# EasyEDA schematic Voxx Dott.json
TITLE: Voxx Dott; REV: 1.0; Date: 2026-04-01; Sheet: 1/1; Drawn By: timweiberg; Company: Your Company
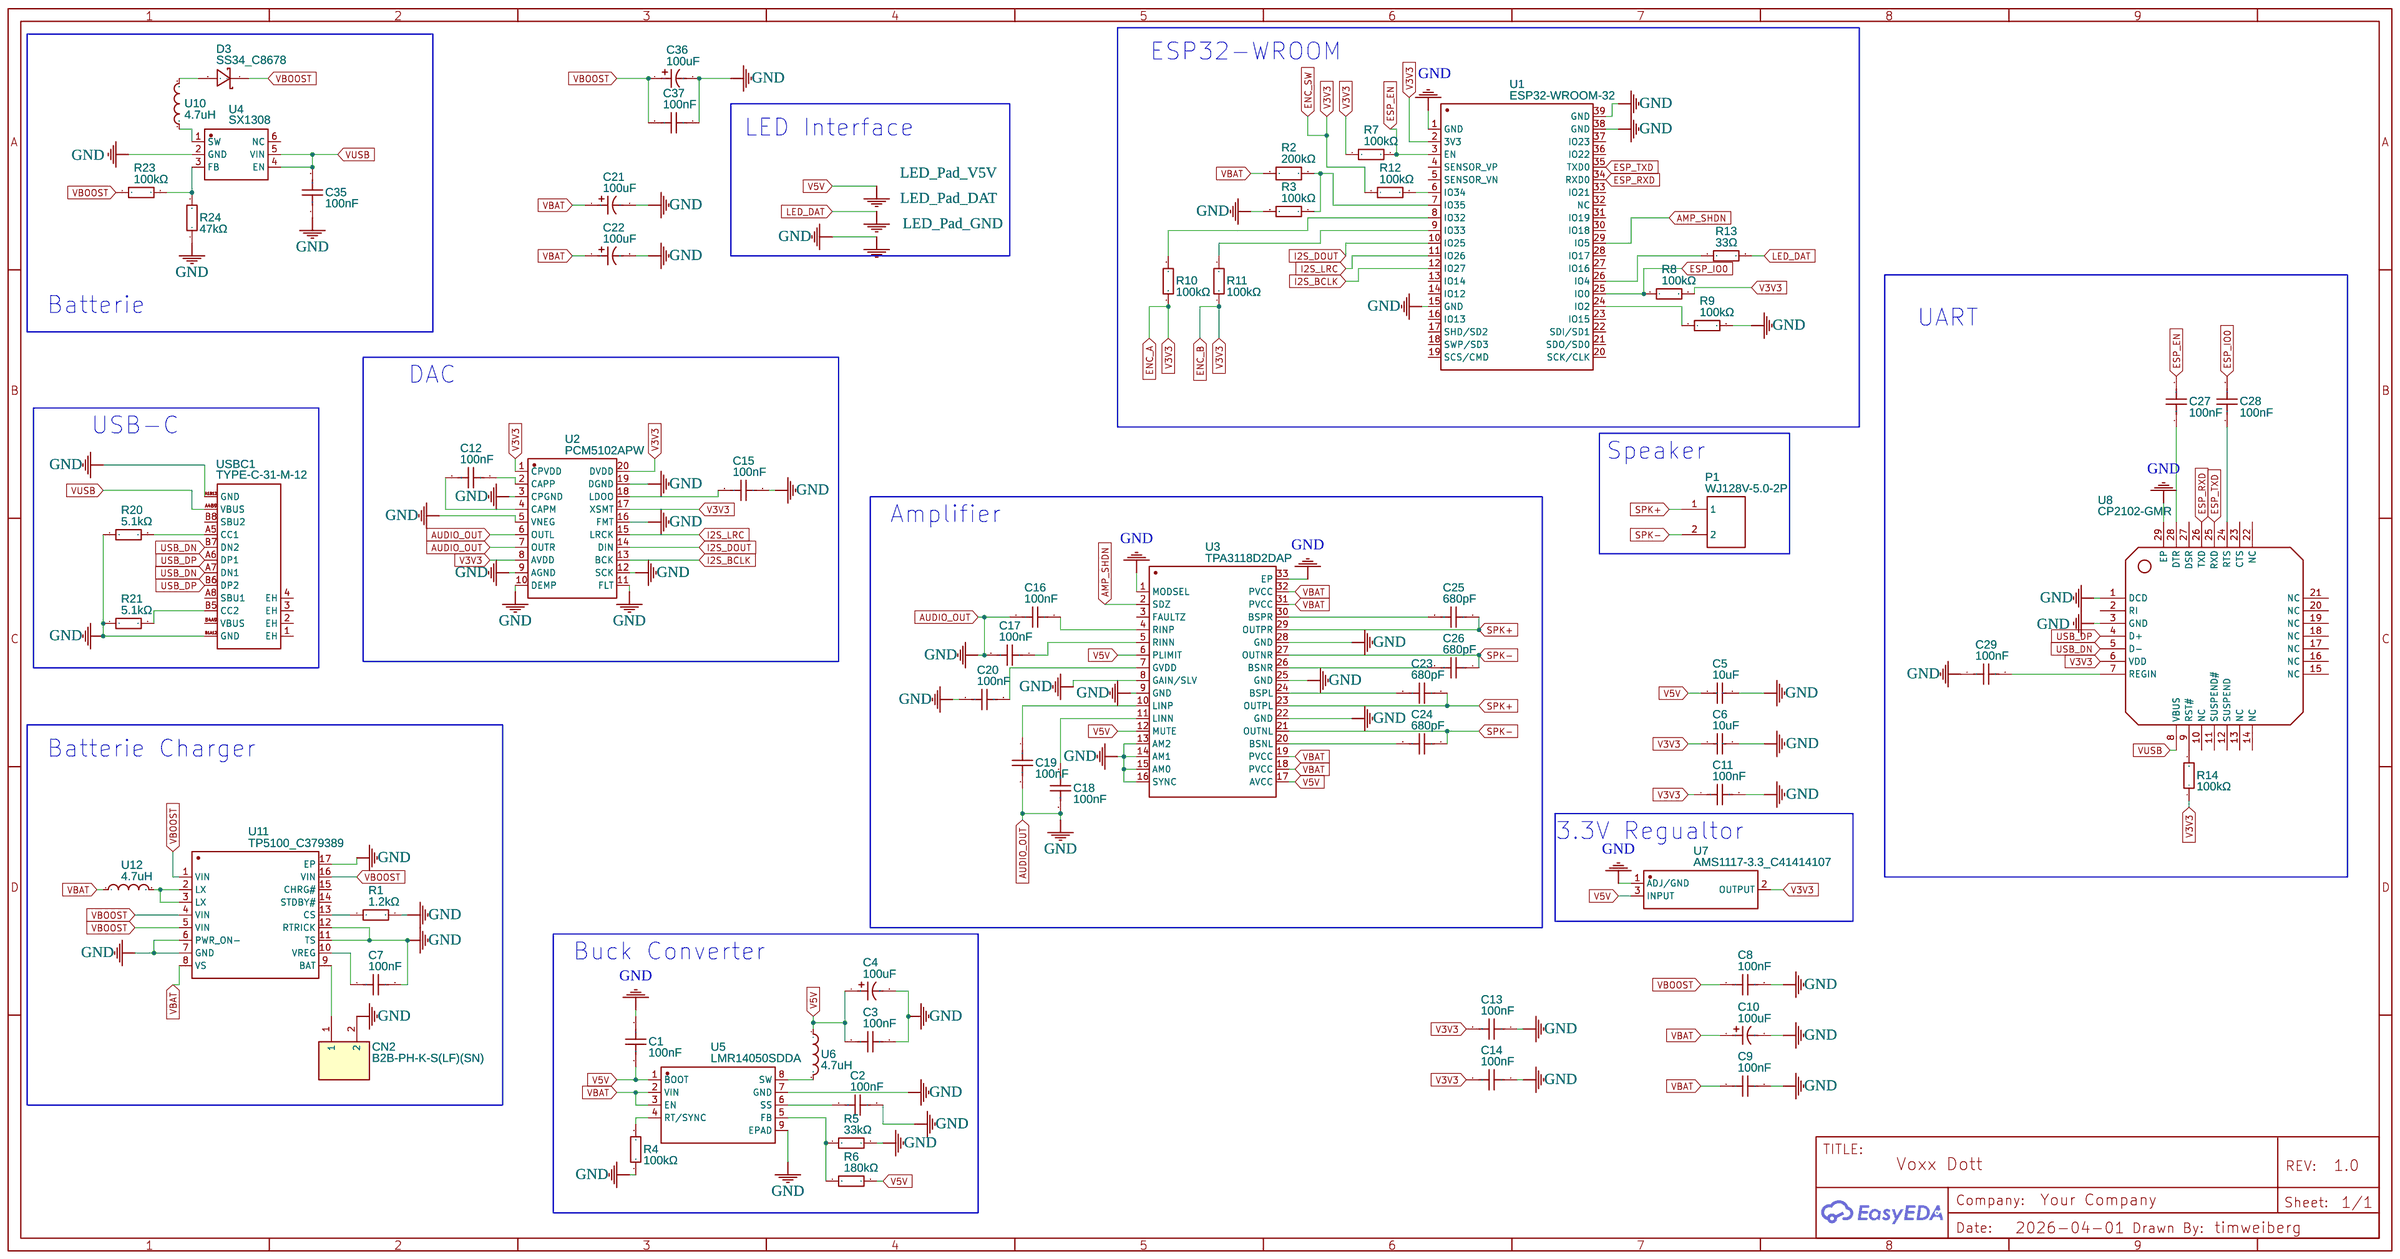
[diagram p0: schematic sheet]

## Parts
C1  100nF  [C0402]
C2  100nF  [C0402]
C3  100nF  [C0402]
C4  100uF  [CAP-SMD_BD6.3-L6.6-W6.6-LS7.3-FD]
C5  10uF  [C0805]
C6  10uF  [C0805]
C7  100nF  [C0402]
C8  100nF  [C0402]
C9  100nF  [C0402]
C10  100uF  [CAP-SMD_BD6.3-L6.6-W6.6-LS7.3-FD]
C11  100nF  [C0402]
C12  100nF  [C0402]
C13  100nF  [C0402]
C14  100nF  [C0402]
C15  100nF  [C0402]
C16  100nF  [C0402]
C17  100nF  [C0402]
C18  100nF  [C0402]
C19  100nF  [C0402]
C20  100nF  [C0402]
C21  100uF  [CAP-SMD_BD6.3-L6.6-W6.6-LS7.3-FD]
C22  100uF  [CAP-SMD_BD6.3-L6.6-W6.6-LS7.3-FD]
C23  680pF  [C0402]
C24  680pF  [C0402]
C25  680pF  [C0402]
C26  680pF  [C0402]
C27  100nF  [C0402]
C28  100nF  [C0402]
C29  100nF  [C0402]
C35  100nF  [C0402]
C36  100uF  [CAP-SMD_BD6.3-L6.6-W6.6-LS7.3-FD]
C37  100nF  [C0402]
CN2  B2B-PH-K-S(LF)(SN)  [CONN-TH_B2B-PH-K-S]
D3  SS34_C8678  [SMA_L4.3-W2.6-LS5.2-RD]
P1  WJ128V-5.0-2P  [CONN-TH_2P-P5.00_WJ128V-5.0-2P]
R1  1.2kΩ  [R0402]
R2  200kΩ  [R0402]
R3  100kΩ  [R0402]
R4  100kΩ  [R0402]
R5  33kΩ  [R0402]
R6  180kΩ  [R0402]
R7  100kΩ  [R0402]
R8  100kΩ  [R0402]
R9  100kΩ  [R0402]
R10  100kΩ  [R0402]
R11  100kΩ  [R0402]
R12  100kΩ  [R0402]
R13  33Ω  [R0402]
R14  100kΩ  [R0402]
R20  5.1kΩ  [R0402]
R21  5.1kΩ  [R0402]
R23  100kΩ  [R0402]
R24  47kΩ  [R0402]
U1  ESP32-WROOM-32  [WIFIM-SMD_ESP32-WROOM-32-N4]
U2  PCM5102APW  [TSSOP-20_L6.5-W4.4-P0.65-LS6.4-BL]
U3  TPA3118D2DAP  [HTSSOP-32_L11.0-W6.1-P0.65-LS8.1-BL-EP]
U4  SX1308  [SOT-23-6_L2.9-W1.6-P0.95-LS2.8-BL]
U5  LMR14050SDDA  [SOP-8_L4.9-W3.9-P1.27-LS6.0-BL-EP-2]
U6  4.7uH  [IND-SMD_L7.0-W6.6_APH0630]
U7  AMS1117-3.3_C41414107  [TO-252-2_L6.6-W5.6-P2.3-LS9.7]
U8  CP2102-GMR  [WQFN-28_L5.0-W5.0-P0.50-BL-EP3.2]
U10  4.7uH  [IND-SMD_L7.0-W6.6_APH0630]
U11  TP5100_C379389  [TQFN-16_L4.0-W4.0-P0.65-BL-EP]
U12  4.7uH  [IND-SMD_L7.0-W6.6_APH0630]
USBC1  TYPE-C-31-M-12  [USB-C_SMD-TYPE-C-31-M-12_1]

## Library data of the parts
C1-C3 C7-C9 C11-C20 C27-C29 C35 C37 = CC0402X7R50V104KN: Supplier: LCSC; Supplier Part: C53084447; Manufacturer: TORCH(火炬); Contributor: lcsc; JLCPCB Part Class: Extended Part
C4 C10 C21 C22 C36 = MA16V100M6X8: Supplier: LCSC; Supplier Part: C48971042; Manufacturer: JIERR(捷而瑞); JLCPCB Part Class: Extended Part; Contributor: lcsc
C5 C6 = CL21B106KPQNNNE: Supplier: LCSC; Manufacturer: SAMSUNG(三星); Supplier Part: C32635; JLCPCB Part Class: Extended Part
C23-C26 = CL05C681JB5NNNC: Contributor: LCSC; Supplier: LCSC; Supplier Part: C307451; Manufacturer: SAMSUNG(三星); JLCPCB Part Class: Extended Part
CN2 = B2B-PH-K-S(LF)(SN): Contributor: LCSC; Supplier: LCSC; Manufacturer: JST; Supplier Part: C131337; JLCPCB Part Class: Extended Part
D3 = SS34_C8678: Supplier: LCSC; Manufacturer Part: SS34; Manufacturer: MDD(辰达半导体); Supplier Part: C8678; JLCPCB Part Class: Basic Part
P1 = WJ128V-5.0-2P: Supplier: LCSC; Manufacturer: KANGNEX(康奈克斯电气); Manufacturer Part: WJ128V-5.0-02P-14-00A; Supplier Part: C8269; JLCPCB Part Class: Extended Part
R1 = RC0402FR-071K2L: Supplier: LCSC; Manufacturer: YAGEO(国巨); Supplier Part: C138040; JLCPCB Part Class: Extended Part
R2 = FRC0402F2003TS: Supplier: LCSC; Supplier Part: C2906866; Manufacturer: FOJAN(富捷); JLCPCB Part Class: Extended Part; Contributor: lcsc
R3 R4 R7-R12 R14 R23 = RC0402FR-07100KL: Supplier: LCSC; Manufacturer: YAGEO(国巨); Supplier Part: C60491; JLCPCB Part Class: Extended Part
R5 = RC0402FR-0733KL: Supplier: LCSC; Manufacturer: YAGEO(国巨); Supplier Part: C138003; JLCPCB Part Class: Extended Part
R6 = RC0402FR-07100KL: Supplier: LCSC; Manufacturer: YAGEO(国巨); Supplier Part: C138046; JLCPCB Part Class: Extended Part
R13 = RC0402FR-0733RL: Contributor: LCSC; Supplier: LCSC; Manufacturer: YAGEO(国巨); Supplier Part: C138002; JLCPCB Part Class: Extended Part
R20 R21 = RC0402FR-075K1L: Supplier: LCSC; Manufacturer: YAGEO(国巨); Supplier Part: C105872; JLCPCB Part Class: Extended Part
R24 = RC0402FR-0747KL: Supplier: LCSC; Manufacturer: YAGEO(国巨); Supplier Part: C93943; JLCPCB Part Class: Extended Part
U1 = ESP32-WROOM-32: Contributor: LCSC; Supplier: LCSC; Supplier Part: C82899; Manufacturer: ESPRESSIF(乐鑫); Manufacturer Part: ESP32-WROOM-32-N4; JLCPCB Part Class: Extended Part
U2 = PCM5102APW: Supplier: LCSC; Supplier Part: C1520792; Manufacturer: TI(德州仪器); JLCPCB Part Class: Extended Part; Contributor: lcsc
U3 = TPA3118D2DAP: Contributor: LCSC; Supplier: LCSC; Supplier Part: C2879312; Manufacturer: TI(德州仪器); JLCPCB Part Class: Extended Part
U4 = SX1308: sourceId: g4Yg9rJ1j; Supplier: LCSC; Manufacturer: SX(硕芯科技); Supplier Part: C78162; JLCPCB Part Class: Extended Part
U5 = LMR14050SDDA: Contributor: LCSC; Supplier: LCSC; Supplier Part: C98458; Manufacturer: TI(德州仪器); JLCPCB Part Class: Extended Part
U6 U10 U12 = APH0630T4R7M: Supplier: LCSC; Supplier Part: C5349705; Manufacturer: APV(爱普微); JLCPCB Part Class: Extended Part; Contributor: lcsc
U7 = AMS1117-3.3_C41414107: Supplier: LCSC; Supplier Part: C41414107; Manufacturer: YONGYUTAI(永裕泰); Manufacturer Part: AMS1117-3.3; JLCPCB Part Class: Extended Part; Contributor: lcsc; link: https://lcsc.com/eda_search?q=C41414107&%26type=1&ref=editor
U8 = CP2102-GMR: Supplier: LCSC; Manufacturer: SKYWORKS/SILICON LABS(芯科); Supplier Part: C6568; JLCPCB Part Class: Extended Part
U11 = TP5100_C379389: Contributor: LCSC; Supplier: LCSC; Supplier Part: C379389; Manufacturer: TOPPOWER(南京拓微); Manufacturer Part: TP5100; JLCPCB Part Class: Extended Part
USBC1 = TYPE-C-31-M-12: Contributor: LCSC; Supplier: LCSC; Supplier Part: C165948; Manufacturer: 韩国韩荣; JLCPCB Part Class: Extended Part

## Nets
VBAT: C9.1 C10.1 C21.1 C22.1 R2.1 U3.18(PVCC) U3.19(PVCC) U3.31(PVCC) U3.32(PVCC) U5.2(VIN) U5.3(EN) U11.8(VS) U12.1
AMP_SHDN: U1.29(IO5) U3.2(SDZ)
AUDIO_OUT: C1.2 C2.2 C3.1 C4.2 C5.2 C6.2 C7.2 C8.2 C9.2 C10.2 C11.2 C13.1 C14.1 C15.1 C16.2 C17.2 C18.2 C19.2 C20.1 C21.2 C22.2 C29.1 C35.1 C36.2 C37.1 CN2.2 R1.2 R3.2 R4.1 R5.2 R9.2 R20.1 R21.1 R24.1 U1.1(GND) U1.15(GND) U1.38(GND) U1.39(GND) U2.3(CPGND) U2.5(VNEG) U2.6(OUTL) U2.7(OUTR) U2.9(AGND) U2.10(DEMP) U2.11(FLT) U2.12(SCK) U2.16(FMT) U2.19(DGND) U3.1(MODSEL) U3.8(GAIN/SLV) U3.9(GND) U3.13(AM2) U3.14(AM1) U3.15(AM0) U3.16(SYNC) U3.22(GND) U3.25(GND) U3.28(GND) U3.33(EP) U4.2(GND) U5.7(GND) U5.9(EPAD) U7.1(ADJ/GND) U8.1(DCD) U8.3(GND) U8.29(EP) U11.6(PWR_ON-) U11.7(GND) U11.11(TS) U11.12(RTRICK) U11.17(EP) USBC1.A1B12(GND) USBC1.B1A12(GND)
ENC_A: C6.1 C11.1 C13.2 C14.2 R7.1 R8.2 R10.1 R11.1 R12.1 R14.1 U1.2(3V3) U2.1(CPVDD) U2.8(AVDD) U2.17(XSMT) U2.20(DVDD) U7.2(OUTPUT) U8.6(VDD)
ESP_EN: C27.2 R7.2 U1.3(EN)
ESP_IO0: C28.2 R8.1 U1.25(IO0)
ESP_RXD: U1.34(RXD0) U8.26(TXD)
ESP_TXD: U1.35(TXD0) U8.25(RXD)
I2S_BCLK: U1.12(IO27) U2.13(BCK)
I2S_DOUT: U1.10(IO25) U2.14(DIN)
I2S_LRC: U1.11(IO26) U2.15(LRCK)
LED_DAT: R13.2
LED_Pad_V5V: C1.1 C3.2 C4.1 C5.1 R6.2 U3.6(PLIMIT) U3.12(MUTE) U3.17(AVCC) U5.1(BOOT) U6.1 U7.3(INPUT)
SPK+: C23.1 C25.1 P1.1 U3.23(OUTPL) U3.29(OUTPR)
SPK-: C24.1 C26.1 P1.2 U3.21(OUTNL) U3.27(OUTNR)
USB_DN: U8.5(D-) USBC1.A7(DN1) USBC1.B7(DN2)
USB_DP: U8.4(D+) USBC1.A6(DP1) USBC1.B6(DP2)
VBOOST: C8.1 C36.1 C37.2 D3.1(K) R23.1 U11.1(VIN) U11.4(VIN) U11.5(VIN) U11.16(VIN)
VUSB: C35.2 U4.4(EN) U4.5(VIN) U8.8(VBUS) USBC1.A4B9(VBUS)
Net-(C2-1): C2.1 U5.6(SS)
Net-(C7-1): C7.1 U11.10(VREG)
Net-(C12-1): C12.1 U2.2(CAPP)
Net-(C12-2): C12.2 U2.4(CAPM)
Net-(C15-2): C15.2 U2.18(LDOO)
Net-(C16-1): C16.1 U3.4(RINP)
Net-(C17-1): C17.1 U3.5(RINN)
Net-(C18-1): C18.1 U3.11(LINN)
Net-(C19-1): C19.1 U3.10(LINP)
Net-(C20-2): C20.2 U3.7(GVDD)
Net-(C23-2): C23.2 U3.24(BSPL)
Net-(C24-2): C24.2 U3.20(BSNL)
Net-(C25-2): C25.2 U3.30(BSPR)
Net-(C26-2): C26.2 U3.26(BSNR)
Net-(C27-1): C27.1 U8.28(DTR)
Net-(C28-1): C28.1 U8.24(RTS)
Net-(C29-2): C29.2 U8.7(REGIN)
Net-(CN2-1): CN2.1 U11.9(BAT)
Net-(D3-2): D3.2(A) U10.2
Net-(R1-1): R1.1 U11.13(CS)
Net-(R2-2): R2.2 R3.1 U1.7(IO35)
Net-(R4-2): R4.2 U5.4(RT/SYNC)
Net-(R5-1): R5.1 R6.1 U5.5(FB)
Net-(R9-1): R9.1 U1.24(IO2)
Net-(R10-2): R10.2 U1.8(IO32)
Net-(R11-2): R11.2 U1.9(IO33)
Net-(R12-2): R12.2 U1.6(IO34)
Net-(R13-1): R13.1 U1.26(IO4)
Net-(R14-2): R14.2 U8.9(RST#)
Net-(R20-2): R20.2 USBC1.A5(CC1)
Net-(R21-2): R21.2 USBC1.B5(CC2)
Net-(R23-2): R23.2 R24.2 U4.3(FB)
Net-(U4-1): U4.1(SW) U10.1
Net-(U5-8): U5.8(SW) U6.2
Net-(U11-2): U11.2(LX) U11.3(LX) U12.2

Not connected (* = marked no-connect by the designer): U1 4(SENSOR_VP) 5(SENSOR_VN) 13(IO14) 14(IO12) 16(IO13) 17(SHD/SD2) 18(SWP/SD3) 19(SCS/CMD) 20(SCK/CLK) 21(SDO/SD0) 22(SDI/SD1) 23(IO15) 27(IO16) 28(IO17) 30(IO18) 31(IO19) 32(NC) 33(IO21) 36(IO22) 37(IO23); U3 3(FAULTZ); U4 6(NC); U8 2(RI) 10(NC) 11(SUSPEND#) 12(SUSPEND) 13(NC) 14(NC) 15(NC) 16(NC) 17(NC) 18(NC) 19(NC) 20(NC) 21(NC) 22(NC) 23(CTS) 27(DSR); U11 14(STDBY#) 15(CHRG#); USBC1 1(EH) 2(EH) 3(EH) 4(EH) A8(SBU1) B4A9(VBUS) B8(SBU2)

## Notes on the sheet
- ESP32-WROOM
- LED Interface
- Batterie
- UART
- DAC
- USB-C
- Speaker
- Amplifier
- Batterie Charger
- 3.3V Regualtor
- Buck Converter
